# EAGLE design NP-100v12 (EAGLE 6.5.0)
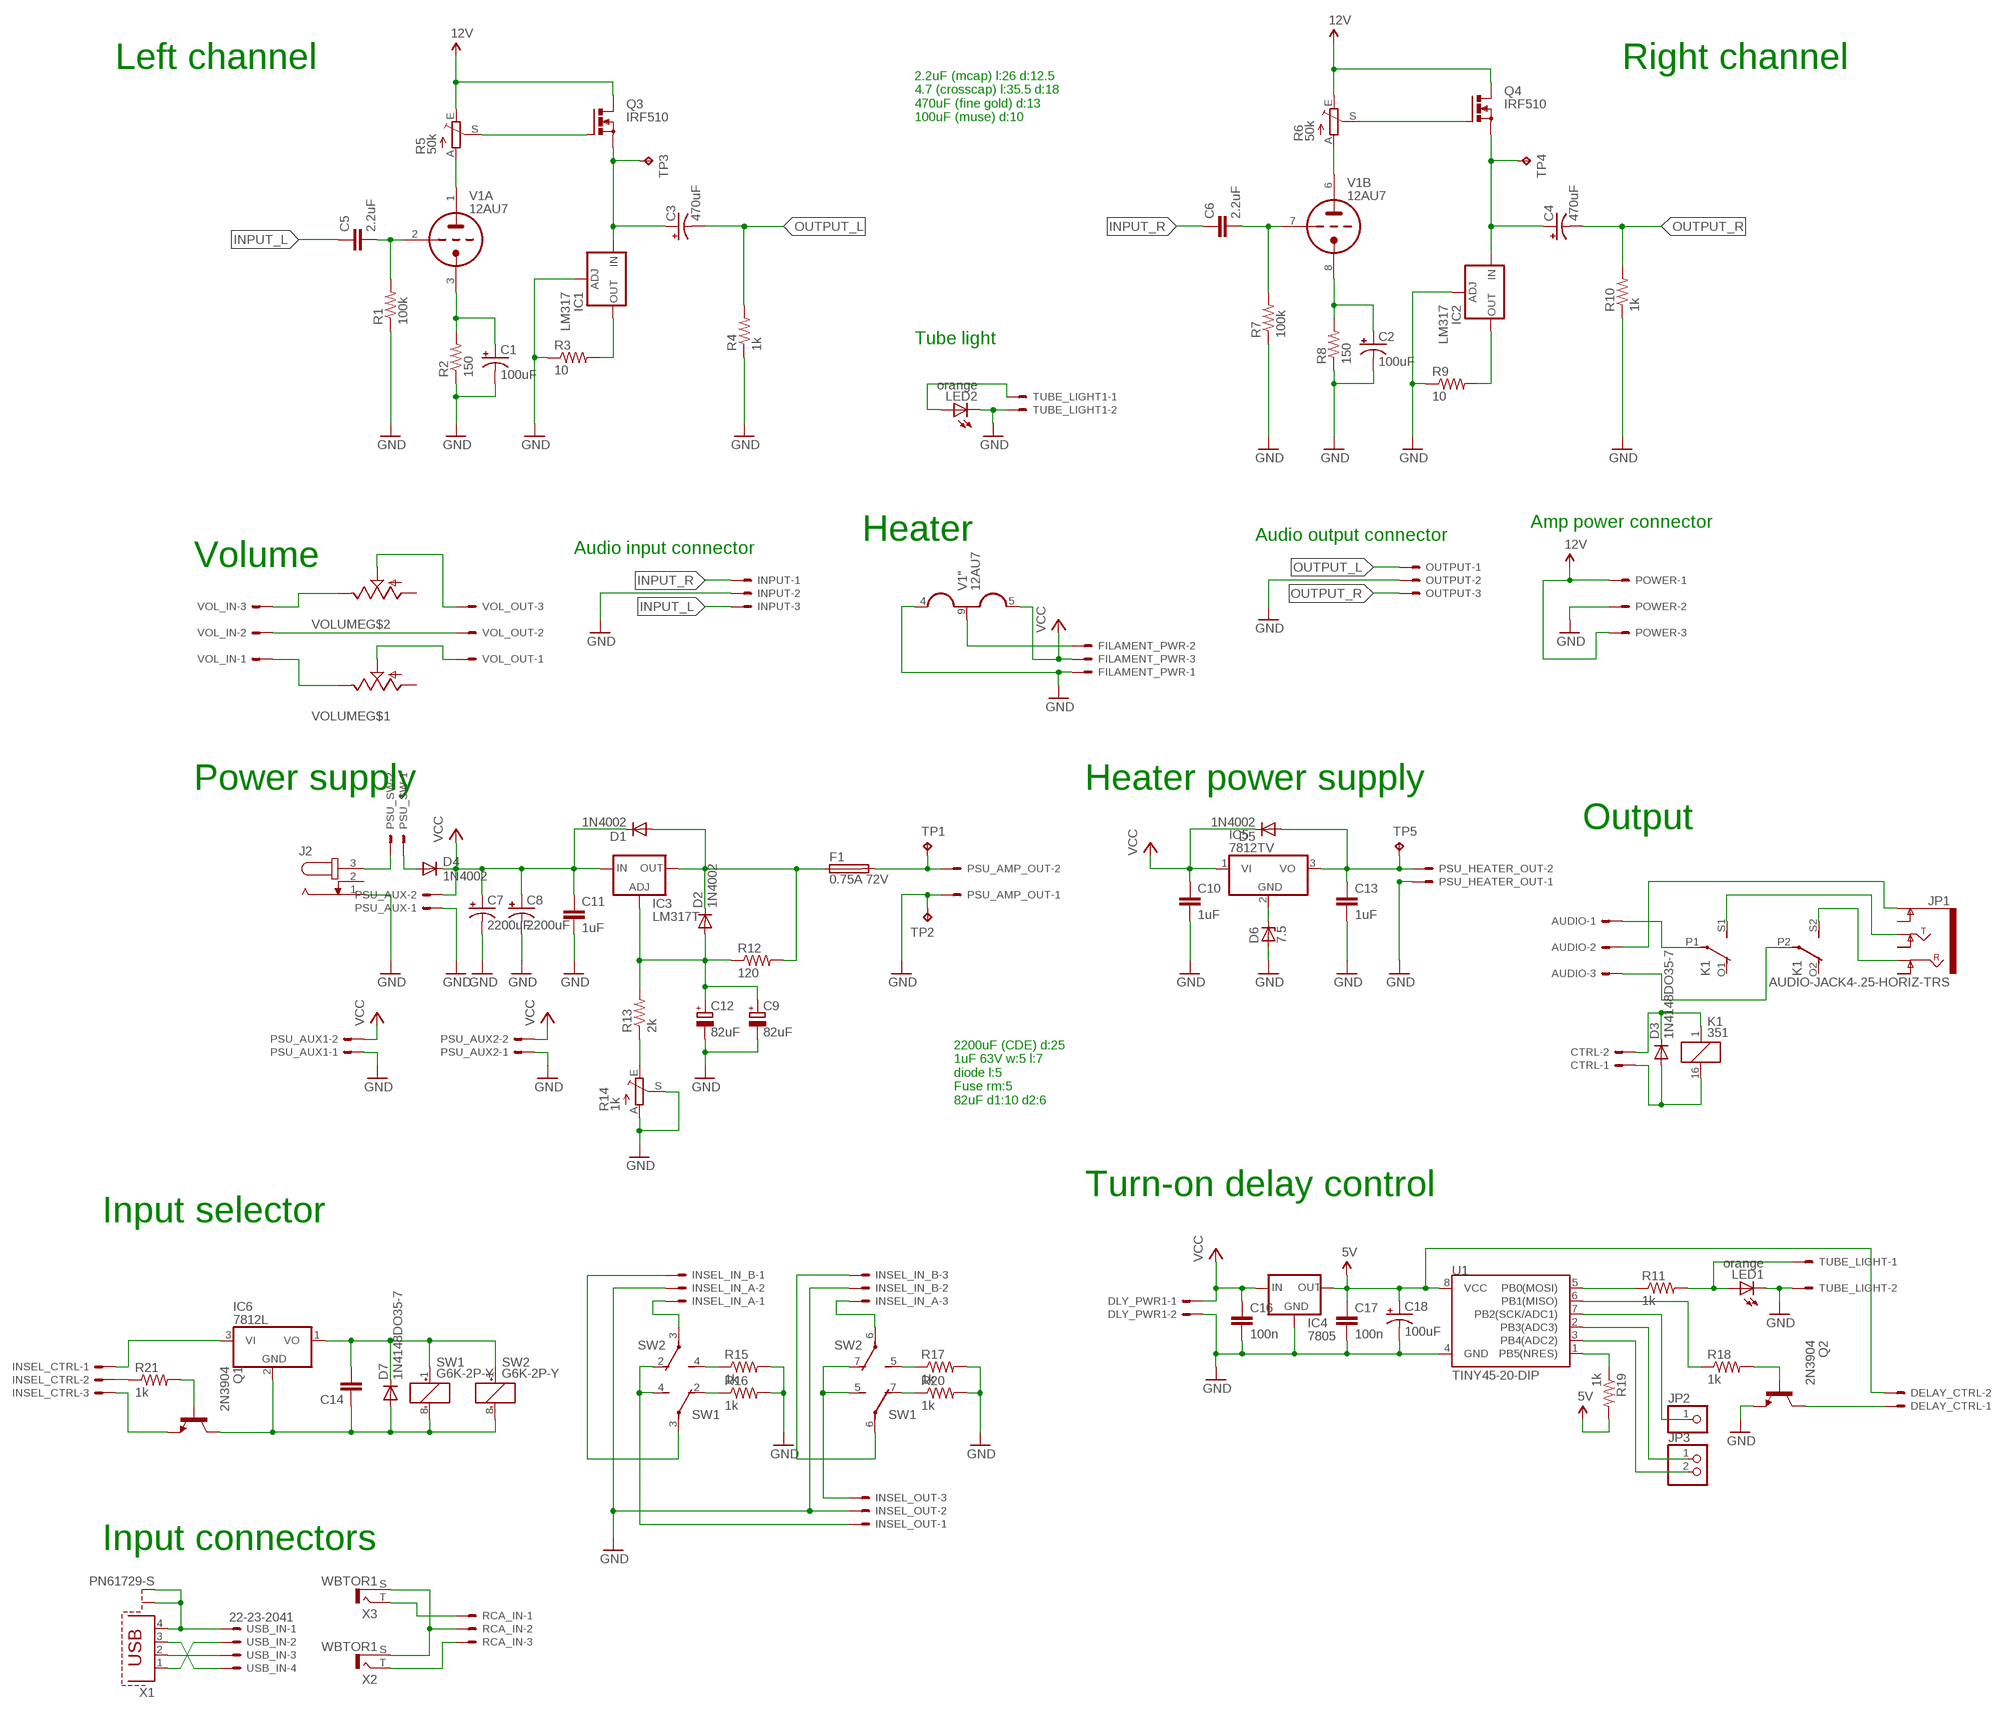
[diagram p0: schematic, sheet 1]

## Parts
AUDIO  22-23-2031  [22-23-2031]
C1  100uF  CPOL-USE5-10.5  [E5-10,5]
C2  100uF  CPOL-USE5-10.5  [E5-10,5]
C3  470uF  CPOL-USE5-13  [E5-13]
C4  470uF  CPOL-USE5-13  [E5-13]
C5  2.2uF  C37/19  [C37.5B19]
C6  2.2uF  C37/19  [C37.5B19]
C7  2200uF  CPOL-USE10-25  [EB25D]
C8  2200uF  CPOL-USE10-25  [EB25D]
C9  82uF  CPOL-EUE2.5-6  [E2,5-6]
C10  1uF  C5/4.5  [C5B4.5]
C11  1uF  C5/4.5  [C5B4.5]
C12  82uF  CPOL-EUE5-10.5  [E5-10,5]
C13  1uF  C5/4.5  [C5B4.5]
C14  C5/2.5  [C5B2.5]
C16  100n  CAPPTH1  [CAP-PTH-5MM]
C17  100n  CAPPTH1  [CAP-PTH-5MM]
C18  100uF  CPOL-USE2.5-7  [E2,5-7]
CTRL  22-23-2021  [22-23-2021]
D1  1N4002  DIODE-D-7.5  [D-7.5]
D2  1N4002  DIODE-D-7.5  [D-7.5]
D3  1N4148DO35-7  [DO35-7]
D4  1N4002  DIODE-D-5  [D-5]
D5  1N4002  DIODE-D-7.5  [D-7.5]
D6  7.5  ZENER-DIODEDO34-7  [DO34Z7]
D7  1N4148DO35-7  [DO35-7]
DELAY_CTRL  22-23-2021  [22-23-2021]
DLY_PWR1  22-23-2021  [22-23-2021]
F1  0.75A 72V  TE5  [TE5]
FILAMENT_PWR  22-23-2031  [22-23-2031]
IC1  LM317  LM317TS  [317TS]
IC2  LM317  LM317TS  [317TS]
IC3  LM317T  LM317TS  [317TS]
IC4  7805  V_REG_78XXTO-92_UNTESTED  [TO-92]
IC5  7812TV  [TO220V]
IC6  7812L  [TO92]
INPUT  22-23-2031  [22-23-2031]
INSEL_CTRL  22-23-2031  [22-23-2031]
INSEL_IN_A  22-23-2031  [22-23-2031]
INSEL_IN_B  22-23-2031  [22-23-2031]
INSEL_OUT  22-23-2031  [22-23-2031]
J2  JACK-PLUG0  [SPC4077]
JP1  AUDIO-JACK4-.25-HORIZ-TRS  [AUDIO-JACK-.25-INCH-HORIZ-PTH]
JP2  PINHD-1X1  [1X01]
JP3  PINHD-1X2  [1X02]
K1  351  [351]
LED1  orange  LED3MM  [LED3MM]
LED2  orange  LED3MM  [LED3MM]
OUTPUT  22-23-2031  [22-23-2031]
POWER  22-23-2031  [22-23-2031]
PSU_AMP_OUT  22-23-2021  [22-23-2021]
PSU_AUX  22-23-2021  [22-23-2021]
PSU_AUX1  22-23-2021  [22-23-2021]
PSU_AUX2  22-23-2021  [22-23-2021]
PSU_HEATER_OUT  22-23-2021  [22-23-2021]
PSU_SW  22-23-2021  [22-23-2021]
Q1  2N3904  [TO92]
Q2  2N3904  [TO92]
Q3  IRF510  PMOSFET_NTO220BV  [TO220BV]
Q4  IRF510  PMOSFET_NTO220BV  [TO220BV]
R1  100k  R-US_0207/10  [0207/10]
R2  150  R-US_0207/10  [0207/10]
R3  10  R-US_0207/10  [0207/10]
R4  1k  R-US_0207/10  [0207/10]
R5  50k  TRIM_EU-B90P  [SP19L]
R6  50k  TRIM_EU-B90P  [SP19L]
R7  100k  R-US_0207/10  [0207/10]
R8  150  R-US_0207/10  [0207/10]
R9  10  R-US_0207/10  [0207/10]
R10  1k  R-US_0207/10  [0207/10]
R11  1k  R-US_0204/7  [0204/7]
R12  120  RESISTORAXIAL-0.3  [AXIAL-0.3]
R13  2k  RESISTORAXIAL-0.3  [AXIAL-0.3]
R14  1k  TRIM_EU-S64Y  [S64Y]
R15  1k  RESISTORAXIAL-0.3  [AXIAL-0.3]
R16  1k  RESISTORAXIAL-0.3  [AXIAL-0.3]
R17  1k  RESISTORAXIAL-0.3  [AXIAL-0.3]
R18  1k  R-US_0204/7  [0204/7]
R19  1k  R-US_0204/7  [0204/7]
R20  1k  RESISTORAXIAL-0.3  [AXIAL-0.3]
R21  1k  R-US_0204/7  [0204/7]
RCA_IN  22-23-2031  [22-23-2031]
SW1  G6K-2P-Y  [G6K-2P-Y]
SW2  G6K-2P-Y  [G6K-2P-Y]
TP1  TPPAD1-17  [P1-17]
TP2  TPPAD1-17  [P1-17]
TP3  TPPAD1-17  [P1-17]
TP4  TPPAD1-17  [P1-17]
TP5  TPPAD1-17  [P1-17]
TUBE_LIGHT  22-23-2021  [22-23-2021]
TUBE_LIGHT1  22-23-2021  [22-23-2021]
U1  TINY45-20-DIP  ATTINY45TINY45-20-DIP  [DIP08]
USB_IN  22-23-2041  [22-23-2041]
V1  12AU7  12AU7-P  [NOVAL]
VOL_IN  22-23-2031  [22-23-2031]
VOL_OUT  22-23-2031  [22-23-2031]
VOLUME  ALPS_BLUE  [ALPS_RK27]
X1  PN61729-S  [PN61729-S]
X2  WBTOR1  [WBTOR1]
X3  WBTOR1  [WBTOR1]

## Nets
5V: C17.1 C18.+ DELAY_CTRL.2 IC4.3(OUT) R19.2 U1.8(VCC)
12V: POWER.1 POWER.3 Q3.D Q4.D R5.E R6.E
GND: C1.- C2.- C7.- C8.- C9.- C10.2 C11.2 C12.- C13.2 C16.2 C17.2 C18.- D6.A DLY_PWR1.2 FILAMENT_PWR.1 IC1.1(ADJ) IC2.1(ADJ) IC4.1(GND) INPUT.2 INSEL_IN_A.2 INSEL_IN_B.2 INSEL_OUT.2 J2.1 LED1.K(C) LED2.K(C) OUTPUT.2 POWER.2 PSU_AMP_OUT.1 PSU_AUX1.1 PSU_AUX2.1 PSU_AUX.1 PSU_HEATER_OUT.1 Q2.3(E) R1.1 R2.1 R3.1 R4.1 R7.1 R8.1 R9.1 R10.1 R14.A R14.S R15.P$2 R16.P$2 R17.P$2 R20.P$2 TP2.TP TUBE_LIGHT1.2 TUBE_LIGHT.2 U1.4(GND) V1.4(":H1)
INPUT_L: C5.1 INPUT.3
INPUT_R: C6.1 INPUT.1
N$1: C5.2 R1.2 V1.2(A:TG)
N$2: C1.+ R2.2 V1.3(A:TK)
N$3: R5.A V1.1(A:TA)
N$4: Q3.G R5.S
N$5: C3.+ IC1.3(IN) Q3.S TP3.TP
N$6: IC1.2(OUT) R3.2
N$7: C6.2 R7.2 V1.7(B:TG)
N$8: R11.1 U1.5(PB0(MOSI))
N$9: IC2.2(OUT) R9.2
N$10: C2.+ R8.2 V1.8(B:TK)
N$11: R6.A V1.6(B:TA)
N$12: Q4.G R6.S
N$13: C4.+ IC2.3(IN) Q4.S TP4.TP
N$14: D6.C IC5.2(GND)
N$15: D1.A D2.C F1.1 IC3.2(OUT) R12.P$2
N$16: F1.2 PSU_AMP_OUT.2 TP1.TP
N$17: C9.+ C12.+ D2.A IC3.1(ADJ) R12.P$1 R13.P$2
N$18: R13.P$1 R14.E
N$19: C13.1 D5.A IC5.3(VO) PSU_HEATER_OUT.2 TP5.TP
N$20: FILAMENT_PWR.2 V1.9(":H2)
N$21: AUDIO.1 K1.P1(2:P)
N$22: CTRL.1 D3.A K1.16
N$23: R15.P$1 SW2.4(2:S)
N$24: LED2.A TUBE_LIGHT1.1
N$25: C14.2 D7.C IC6.1(VO) SW1.1(1:+) SW2.1(1:+)
N$26: R16.P$1 SW1.2(2:O)
N$27: AUDIO.3 K1.P2(3:P)
N$28: JP1.TIP K1.S1(2:S)
N$29: AUDIO.2 JP1.SLEEVE(EARTH)
N$30: JP1.RING K1.S2(3:S)
N$31: VOL_IN.3 VOLUME.I2
N$32: VOL_IN.2 VOL_OUT.2
N$33: VOL_IN.1 VOLUME.I1
N$34: VOL_OUT.3 VOLUME.O2
N$35: VOL_OUT.1 VOLUME.O1
N$36: J2.3 PSU_SW.2
N$37: CTRL.2 D3.C K1.1
N$38: LED1.A R11.2 TUBE_LIGHT.1
N$39: R17.P$1 SW2.5(3:S)
N$40: R18.1 U1.6(PB1(MISO))
N$41: Q2.2(B) R18.2
N$42: DELAY_CTRL.1 Q2.1(C)
N$43: JP2.1 U1.7(PB2(SCK/ADC1))
N$44: R19.1 U1.1(PB5(NRES))
N$45: JP3.1 U1.2(PB3(ADC3))
N$46: JP3.2 U1.3(PB4(ADC2))
N$47: D4.A PSU_SW.1
N$48: R20.P$1 SW1.7(3:O)
N$50: INSEL_IN_A.1 SW2.3(2:P)
N$51: INSEL_IN_A.3 SW2.6(3:P)
N$52: INSEL_IN_B.1 SW1.3(2:P)
N$53: INSEL_IN_B.3 SW1.6(3:P)
N$54: INSEL_OUT.3 SW1.5(3:S) SW2.7(3:O)
N$55: INSEL_OUT.1 SW1.4(2:S) SW2.2(2:O)
N$56: Q1.2(B) R21.2
N$57: IC6.3(VI) INSEL_CTRL.1
N$58: INSEL_CTRL.2 R21.1
N$59: INSEL_CTRL.3 Q1.3(E)
N$60: C14.1 D7.A IC6.2(GND) Q1.1(C) SW1.8(1:-) SW2.8(1:-)
N$61: RCA_IN.2 X2.S X3.S
N$62: RCA_IN.1 X3.T
N$63: RCA_IN.3 X2.T
N$64: USB_IN.1 X1.4 X1.S1 X1.S2
N$65: USB_IN.4 X1.3
N$66: USB_IN.3 X1.2
N$67: USB_IN.2 X1.1
OUTPUT_L: C3.- OUTPUT.1 R4.2
OUTPUT_R: C4.- OUTPUT.3 R10.2
VCC: C7.+ C8.+ C10.1 C11.1 C16.1 D1.C D4.C D5.C DLY_PWR1.1 FILAMENT_PWR.3 IC3.3(IN) IC4.2(IN) IC5.1(VI) PSU_AUX1.2 PSU_AUX2.2 PSU_AUX.2 V1.5(":H3)
Unconnected: J2.2 JP1.RING-NORM JP1.SLEEVE-NORM(EARTH-NORM) JP1.TIP-NORM K1.O1(2:O) K1.O2(3:O) VOLUME.G1 VOLUME.G2

## Notes on the sheet
- Left channel | Right channel
- 2.2uF (mcap) l:26 d:12.5
  4.7 (crosscap) l:35.5 d:18
  470uF (fine gold) d:13
  100uF (muse) d:10
- Tube light
- Amp power connector
- Heater | Audio output connector
- Audio input connector
- Volume
- Power supply | Heater power supply
- Output
- 2200uF (CDE) d:25
  1uF 63V w:5 l:7 
  diode l:5
  Fuse rm:5
  82uF d1:10 d2:6
- Turn-on delay control
- Input selector
- Input connectors

## Library data of the parts
AUDIO FILAMENT_PWR INPUT INSEL_CTRL INSEL_IN_A INSEL_IN_B INSEL_OUT OUTPUT POWER RCA_IN VOL_IN VOL_OUT = con-molex:22-23-2031: .100" (2.54mm) Center Header - 3 Pin; MF: MOLEX; MPN: 22-23-2031; OC_FARNELL: 1462950; OC_NEWARK: 30C0862
C1-C4 C7 C8 C18 = adafruit:CPOL-US: POLARIZED CAPACITOR, American symbol
C5 C6 C10 C11 C13 C14 = capacitor-wima:C: CAPACITOR naming: grid - package width
C9 C12 = resistor:CPOL-EU: POLARIZED CAPACITOR, European symbol
C16 C17 = SparkFun:CAP: Capacitor Standard 0603 ceramic capacitor, and 0.1" leaded capacitor.
CTRL DELAY_CTRL DLY_PWR1 PSU_AMP_OUT PSU_AUX PSU_AUX1 PSU_AUX2 PSU_HEATER_OUT PSU_SW TUBE_LIGHT TUBE_LIGHT1 = con-molex:22-23-2021: .100" (2.54mm) Center Header - 2 Pin; MF: MOLEX; MPN: 22-23-2021; OC_FARNELL: 1462926; OC_NEWARK: 25C3832
D1 D2 D4 D5 = diode:DIODE-: DIODE
D3 D7 = diode:1N4148: DIODE high speed (Philips)
D6 = diode:ZENER-DIODE: Z-Diode
F1 = fuse:TE5: FUSE Wickmann; OC_FARNELL: unknown; OC_NEWARK: unknown
IC1-IC3 = v-reg:LM317TS: VOLTAGE REGULATOR
IC4 = SparkFun-PowerIC:V_REG_78XX: Voltage Regulator Standard 7805 5V regulator. IGO (Input Ground Output). Spark Fun Electronics SKU : COM-00107
IC5 IC6 = linear:78*: Positive VOLTAGE REGULATOR Source: http://cache.national.com/ds/LM/LM78L05.pdf http://www.fairchildsemi.com/ds/LM/LM7805.pdf
J2 = con-jack:JACK-PLUG: DC POWER JACK Power Jack, DC, Right Angle, Through Hole, Rated 5A at 16VDC, PC Terminals Distributor: Farnell (www.Farnell.de) Drawing: 84N1161.pdf / 84N1162.pdf Manufacturer: SPC Technology (www.spctechnology.com) Type: SPC4077 / SPC 4078; OC_FARNELL: unknown; OC_NEWARK: unknown
JP1 = SparkFun-Connectors:AUDIO-JACK4-.25-HORIZ-TRS: 1/4" TRS jack, horizontal Production SKU: COM-11144 Footprint unproven - datasheet and part seem to be slightly different; PROD_ID: COM-11144
JP2 = adafruit:PINHD-1X1: Pin header 1x1 for 0.1" spacing With round pins
JP3 = pinhead:PINHD-1X2: PIN HEADER
K1 = relay:351: RELAY 2 x switch, Omron; OC_FARNELL: unknown; OC_NEWARK: unknown
LED1 LED2 = adafruit:LED: LED OSRAM: - CHIPLED LG R971, LG N971, LY N971, LG Q971, LY Q971, LO R971, LY R971 LH N974, LH R974 LS Q976, LO Q976, LY Q976 LO Q996 - Hyper CHIPLED LW Q18S LB Q993, LB Q99A, LB R99A - SideLED LS A670, LO A670, LY A670, LG A670, LP A670 LB A673, LV A673, LT A673, LW A673 LH A674 LY A675 LS A676, LA A676, LO A676, LY A676, LW A676 LS A679, LY A679, LG A679 - Hyper Micro SIDELED® LS Y876, LA Y876, LO Y876, LY Y876 LT Y87S - SmartLED LW L88C, LW L88S LB L89C, LB L89S, LG L890 LS L89K, LO L89K, LY L89K LS L896, LA L896, LO L896, LY L896 - TOPLED LS T670, LO T670, LY T670, LG T670, LP T670 LSG T670, LSP T670, LSY T670, LOP T670, LYG T670 LG T671, LOG T671, LSG T671 LB T673, LV T673, LT T673, LW T673 LH T674 LS T676, LA T676, LO T676, LY T676, LB T676, LH T676, LSB T676, LW T676 LB T67C, LV T67C, LT T67C, LS T67K, LO T67K, LY T67K, LW E67C LS E67B, LA E67B, LO E67B, LY E67B, LB E67C, LV E67C, LT E67C LW T67C LS T679, LY T679, LG T679 LS T770, LO T770, LY T770, LG T770, LP T770 LB T773, LV T773, LT T773, LW T773 LH T774 LS E675, LA E675, LY E675, LS T675 LS T776, LA T776, LO T776, LY T776, LB T776 LHGB T686 LT T68C, LB T68C - Hyper Mini TOPLED® LB M676 - Mini TOPLED Santana® LG M470 LS M47K, LO M47K, LY M47K Source: http://www.osram.convergy.de/
Q1 Q2 = transistor:2N3904: NPN TRANSISTOR
Q3 Q4 = transistor-power:PMOSFET_N: Power MOSFET N-Channel
R1-R4 R7-R11 R18 R19 R21 = adafruit:R-US_: RESISTOR, American symbol
R5 R6 R14 = pot:TRIM_EU-: POTENTIOMETER
R12 R13 R15-R17 R20 = SparkFun:RESISTOR: Resistor Basic schematic elements and footprints for 0603, 1206, and PTH resistors.
SW1 SW2 = relay:G6K: Low Signal Relay oeiwcsnts1.omron.com/.. D20G6K0100.pdf; MF: OMRON COMPONENTS USA; MPN: G6K-2P-Y DC12; OC_FARNELL: 3937276; OC_NEWARK: 34C3464
TP1-TP5 = testpad:TP: Test pad
U1 = SparkFun-DigitalIC:ATTINY45: Atmel 8-pin 2/4/8kB flash uC; PROD_ID: IC-09439
USB_IN = con-molex:22-23-2041: .100" (2.54mm) Center Header - 4 Pin; MF: MOLEX; MPN: 22-23-2041; OC_FARNELL: 1462920; OC_NEWARK: 38C0355
V1 = tubes:12AU7-P
VOLUME = audio-pots:ALPS_BLUE: Alps Blue potentiometer
X1 = con-berg:PN61729-S: BERG USB connector; OC_FARNELL: unknown; OC_NEWARK: unknown
X2 X3 = con-lumberg:WBTOR1: RCA connectors according to JEITA RC-5231 Cinch RCA-Einbaukupplung nach JEITA RC-5231, abgewinkelte Ausführung Source: http://www.lumberg.de/Produkte/PDFs/WBTOR1.pdf; MPN: WBTOR 1 BLACK; OC_FARNELL: 1200146; OC_NEWARK: 98K2588

## Board
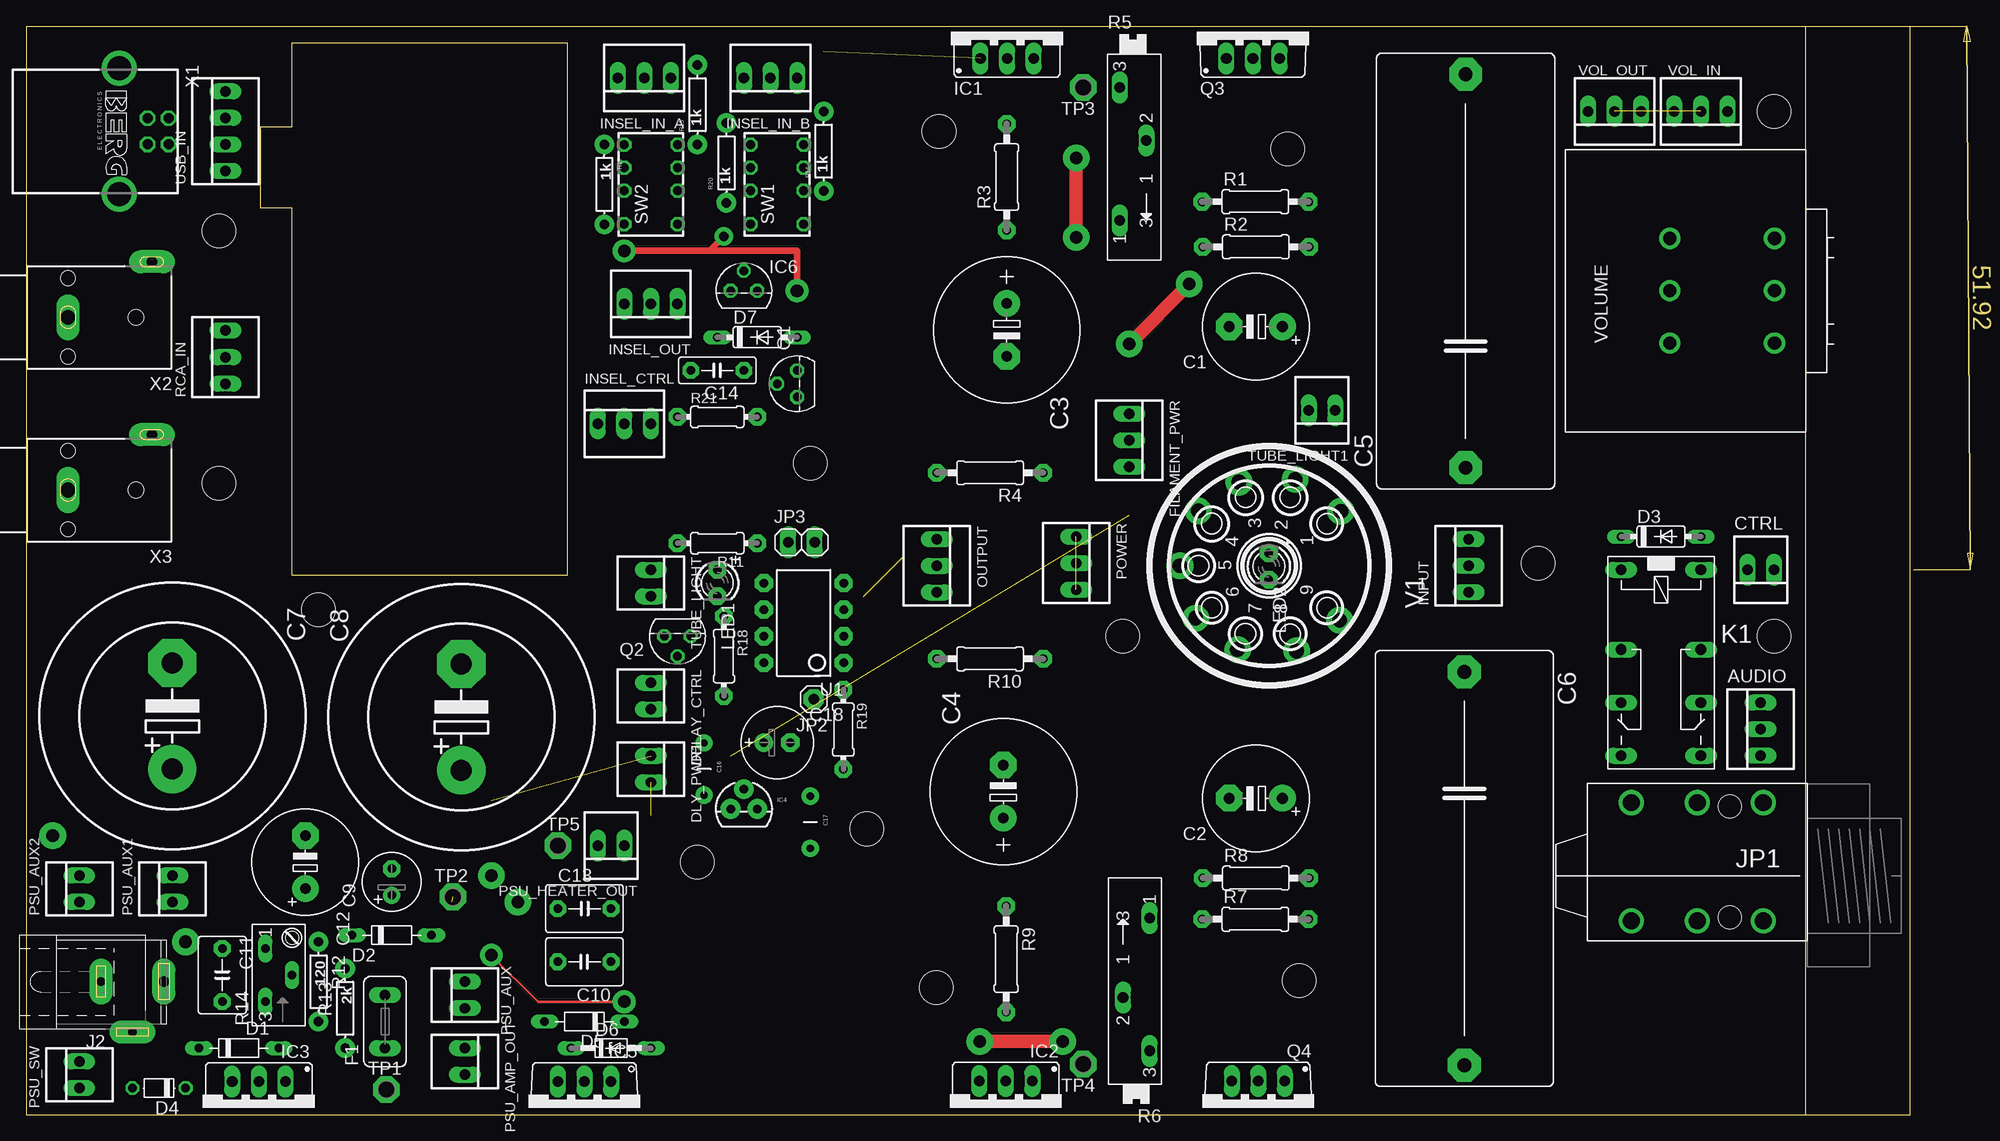
[diagram p1: board, top side]
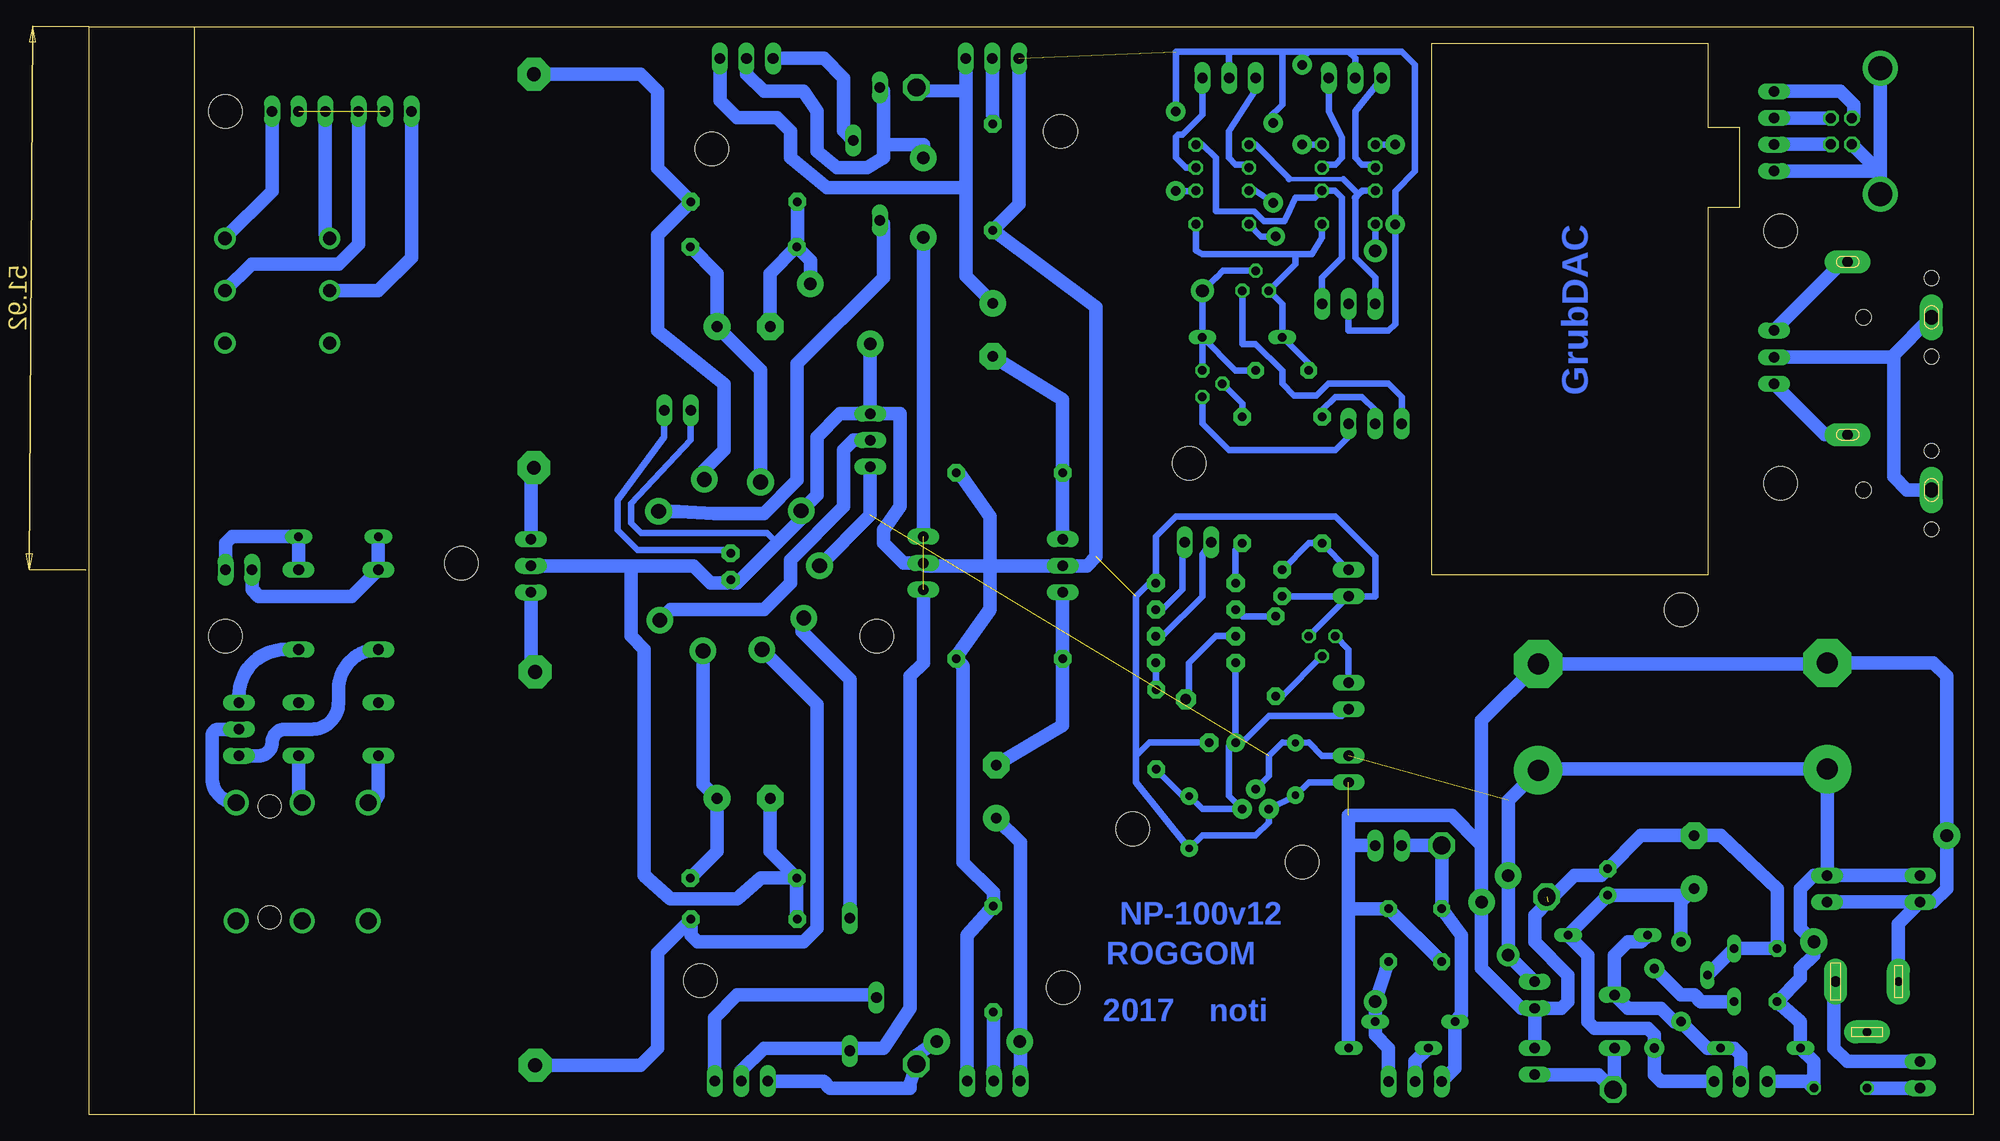
[diagram p2: board, bottom side, seen from below]

Size 180.01 x 103.99 mm. Coordinates in mm from the lower left corner, seen from the top.
Outline: 170,103.99 0,103.99 0,0 170,0
Outline: 170,103.99 180.01,103.99 180.01,0 170,0
Outline: 170,103.99 170,0
Outline: 22.35,86.67 25.35,86.67 25.35,51.59 51.74,51.59 51.74,102.39 25.35,102.39 25.35,94.39 22.35,94.39 22.35,86.67
Copper layers (1*16): Top 0.035mm / dielectric 1.5mm / Bottom 0.035mm
Design rules "default": minimum track width 10mil, minimum drill 24mil, track to track 8mil, track to pad 8mil, pad to pad 8mil, via to via 8mil, smd to smd 8mil, copper to edge 40mil, drill to drill 8mil, minimum pad ring 10mil, minimum via ring 8mil, stop-mask expansion 4mil, vias tented up to drill 0mil, thermal gap 10mil
Holes 3.2 mm at 80.33,27.3 27.94,48.26 144.46,52.7 74.93,62.23 18.41,60.33 64.14,24.13 121.64,12.83 120.52,92.3 167,95.89 167,45.72 87.22,93.98 86.97,12.14 18.41,84.45 104.78,45.72

### Footprints (pad centres in the part's own frame; a part is rotated, then mirrored left to right if it is on the bottom)
22-23-2031 = drill 1 long: 1 -2.54,0; 2 0,0; 3 2.54,0
E5-10,5 = drill 1.016 pad 2.54: + -2.54,0 | drill 1.016 pad 2.54 octagon: - 2.54,0
E5-13 = drill 1.016 pad 2.54: + -2.54,0 | drill 1.016 pad 2.54 octagon: - 2.54,0
C37.5B19 = drill 1.321 pad 3.15 octagon: 1 -18.796,0; 2 18.796,0
EB25D = drill 2.007 pad 4.597: + -5.08,0 | drill 2.007 pad 4.597 octagon: - 5.08,0
E2,5-6 = drill 0.813 pad 1.6: + -1.27,0 | drill 0.813 pad 1.6 octagon: - 1.27,0
C5B4.5 = drill 0.813 pad 1.6 octagon: 1 -2.54,0; 2 2.54,0
C5B2.5 = drill 0.813 pad 1.6 octagon: 1 -2.54,0; 2 2.54,0
CAP-PTH-5MM = drill 0.7 pad 1.651: 1 -2.5,0; 2 2.5,0
E2,5-7 = drill 0.813 pad 1.778: + -1.27,0 | drill 0.813 pad 1.778 octagon: - 1.27,0
22-23-2021 = drill 1 long: 1 -1.27,0; 2 1.27,0
D-7.5 = drill 0.813 long: A 3.81,0; C -3.81,0
DO35-7 = drill 0.813 long: A 3.81,0; C -3.81,0
D-5 = drill 0.813 octagon: A 2.54,0; C -2.54,0
DO34Z7 = drill 0.813 long: A 3.81,0; C -3.81,0
TE5 = drill 1.016 long: 1 -2.54,0; 2 2.54,0
317TS = drill 1.016 long: 1 -2.54,-2.54; 2 0,-2.54; 3 2.54,-2.54
TO-92 = drill 0.813 pad 1.88: 1 -1.27,0; 2 0,1.905; 3 1.27,0
TO220V = drill 1.016 long: 1 -2.54,-2.54; 2 0,-2.54; 3 2.54,-2.54
TO92 = drill 0.813 octagon: 1 -1.27,0; 2 0,1.905; 3 1.27,0
SPC4077 = drill 0.8 pad 2.184 long: 1 -3,0; 2 0,-4.8 | drill 1 pad 2.184 long: 3 3,0
AUDIO-JACK-.25-INCH-HORIZ-PTH = drill 1.6: RING 10.5,-6.95; RING-NORM 10.5,4.35; SLEEVE 4.2,-6.95; SLEEVE-NORM 4.2,4.35; TIP 16.8,-6.95; TIP-NORM 16.8,4.35 | hole 2.2: 7.4,4; 7.4,-6.6
1X01 = drill 1.016 pad 1.93 octagon: 1 0,0
1X02 = drill 1.016 long: 1 -1.27,0; 2 1.27,0
351 = drill 1.016 long: 1 -3.81,-3.81; 16 -3.81,3.81; O1 8.89,-3.81; O2 8.89,3.81; P1 3.81,-3.81; P2 3.81,3.81; S1 13.97,-3.81; S2 13.97,3.81
LED3MM = drill 0.813 pad 1.676 octagon: A -1.27,0; K 1.27,0
TO92' = drill 0.813 octagon: 1 1.27,0; 2 0,1.905; 3 -1.27,0
TO220BV = drill 1.016 long: D 0,-2.54; G -2.54,-2.54; S 2.54,-2.54
0207/10 = drill 0.813 pad 1.676 octagon: 1 -5.08,0; 2 5.08,0
SP19L = drill 1.016 long: A 5.715,-1.27; E -6.985,-1.27; S -1.905,1.27
0204/7 = drill 0.813 pad 1.676 octagon: 1 -3.81,0; 2 3.81,0
AXIAL-0.3 = drill 0.9 pad 1.88: P$1 -3.81,0; P$2 3.81,0
S64Y = drill 0.813 long: A 2.54,1.27; E -2.54,1.27; S 0,-1.27
G6K-2P-Y = drill 0.85 octagon: 1 0,-2.54; 2 3.2,-2.54; 3 5.4,-2.54; 4 7.6,-2.54; 5 7.6,2.54; 6 5.4,2.54; 7 3.2,2.54; 8 0,2.54
P1-17 = drill 1.702 pad 2.54 octagon: TP 0,0
DIP08 = drill 0.813 pad 1.727 octagon: 1 -3.81,-3.81; 2 -1.27,-3.81; 3 1.27,-3.81; 4 3.81,-3.81; 5 3.81,3.81; 6 1.27,3.81; 7 -1.27,3.81; 8 -3.81,3.81
22-23-2041 = drill 1 long: 1 -3.81,0; 2 -1.27,0; 3 1.27,0; 4 3.81,0
NOVAL = drill 1.422 pad 2.54: 1 5.207,-6.858; 2 8.254,-2.484; 3 8.004,2.893; 4 5.258,6.77; 5 0,8.524; 6 -5.004,7.024; 7 -8.004,3.02; 8 -8.127,-2.611; 9 -5.207,-6.731
ALPS_RK27 = drill 1.27 pad 2.032: G1 5,4.5; G2 5,-5.5; I1 -5,4.5; I2 -5,-5.5; O1 0,4.5; O2 0,-5.5
PN61729-S = drill 0.95 octagon: 1 1.25,4.71; 2 -1.25,4.71; 3 -1.25,2.71; 4 1.25,2.71 | drill 2.3 pad 2.9: S1 -6.02,0; S2 6.02,0
WBTOR1 = drill 1.4 pad 2.2 long: S 0,-4 | drill 1 pad 2.2 long: T 5.3,-12 | hole 1.4: -3.75,-4; 3.75,-4 | hole 1.5: 0,-10.5

### Placement (x,y rotation side)
AUDIO  165.74,36.83 90 top
C1  117.5,75.31 180 top
C2  117.5,30.23 180 top
C3  93.69,74.99 270 top
C4  93.37,30.86 90 top
C5  137.54,80.62 90 top
C6  137.41,23.52 270 top
C7  13.97,38.1 90 top
C8  41.58,38 90 top
C9  34.92,22.23 90 top
C10  53.34,14.61 180 top
C11  18.73,13.34 90 top
C12  26.67,24.13 90 top
C13  53.34,19.68 0 top
C14  66.04,71.12 180 top
C16  64.77,33.02 270 top
C17  74.93,27.94 270 top
C18  71.75,35.56 0 top
CTRL  165.74,52.07 180 top
D1  20.32,6.35 0 top
D2  34.92,17.14 0 top
D3  156.21,55.24 0 top
D4  12.7,2.54 180 top
D5  53.34,8.89 180 top
D6  55.88,6.35 0 top
D7  69.85,74.3 0 top
DELAY_CTRL  59.69,40.01 270 top
DLY_PWR1  59.69,33.02 270 top
F1  34.29,8.89 270 top
FILAMENT_PWR  105.41,64.45 270 top
IC1  93.73,103.48 0 top
IC2  93.6,0.66 180 top
IC3  22.23,0.64 180 top
IC4  68.58,29.21 0 top
IC5  53.34,0.64 180 top
IC6  68.58,78.74 0 top
INPUT  137.82,52.45 90 top
INSEL_CTRL  57.15,66.04 0 top
INSEL_IN_A  59.05,99.06 180 top
INSEL_IN_B  71.12,99.06 180 top
INSEL_OUT  59.69,77.47 180 top
J2  10.16,12.7 0 top
JP1  170.18,22.86 180 top
JP2  75.25,39.69 180 top
JP3  74.08,54.69 0 top
K1  156.21,48.26 270 top
LED1  66.04,50.8 270 top
LED2  118.75,52.39 270 top
OUTPUT  87.02,52.45 270 top
POWER  100.33,52.7 270 top
PSU_AMP_OUT  41.91,5.08 270 top
PSU_AUX  41.91,11.43 90 top
PSU_AUX1  13.97,21.59 90 top
PSU_AUX2  5.08,21.59 90 top
PSU_HEATER_OUT  55.88,25.72 180 top
PSU_SW  5.08,3.81 90 top
Q1  2N3904  [TO92']  73.66,69.85 90 top
Q2  2N3904  [TO92']  62.23,45.72 180 top
Q3  117.22,103.48 0 top
Q4  117.73,0.66 180 top
R1  117.45,87.25 0 top
R2  117.5,82.93 0 top
R3  93.69,89.6 90 top
R4  92.1,61.34 180 top
R5  105.75,91.19 270 top
R6  106.07,13.08 90 top
R7  117.45,18.67 0 top
R8  117.5,22.61 0 top
R9  93.64,14.86 270 top
R10  92.1,43.56 180 top
R11  66.04,54.61 180 top
R12  27.94,12.7 270 top
R13  30.48,10.16 270 top
R14  24.13,13.34 90 top
R15  64.14,96.52 90 top
R16  76.2,92.08 90 top
R17  55.24,88.9 270 top
R18  66.67,43.81 270 top
R19  78.08,36.8 270 top
R20  66.9,90.96 90 top
R21  66.04,66.67 0 top
RCA_IN  19.05,72.39 90 top
SW1  71.75,85.09 90 top
SW2  59.69,85.09 90 top
TP1  34.42,2.39 0 top
TP2  40.77,20.8 0 top
TP3  100.99,98.17 180 top
TP4  100.99,4.83 180 top
TP5  50.8,25.72 0 top
TUBE_LIGHT  59.69,50.8 270 top
TUBE_LIGHT1  123.83,67.31 180 top
U1  74.3,46.99 90 top
USB_IN  19.05,93.98 90 top
V1  118.77,52.45 90 top
VOL_IN  160.02,95.89 180 top
VOL_OUT  151.76,95.89 180 top
VOLUME  162.56,78.74 270 top
X1  8.89,93.98 270 top
X2  0,76.2 90 top
X3  0,59.69 90 top

### Tracks (layer width: path | path; a pad name or v marks a point on that pad's centre or on a via)
5V
  Bottom 0.61: R19.2 75.56,30.48 C17.1 73.66,29.21 IC4.3 71.12,30.48 71.12,35.24 C18.+ | C18.+ U1.8 | C18.+ 69.53,35.88 67.31,38.1 60.33,38.1 DELAY_CTRL.2
12V  (via drill 1.2 pad 2.54)  (1 unrouted)
  Top 1.27: v100.33,83.82 v100.33,91.44
  Bottom 1.27: Q4.D 117.73,4.19 115.57,6.35 107.59,6.35 R6.E 107.09,6.35 104.14,6.35 101.6,10.16 101.6,41.91 100.33,43.18 POWER.3 | Q3.D 117.22,99.44 115.57,97.79 111.76,97.79 110.49,95.89 110.49,92.08 108.58,90.49 105.73,90.49 104.14,91.44 104.14,92.71 | 104.14,92.71 104.14,97.83 R5.E | POWER.1 v100.33,83.82 | v100.33,91.44 100.33,92.71 104.14,92.71
GND  (via drill 1.2 pad 2.54)  (4 unrouted)
  Top 1.27: v105.41,73.66 v111.12,79.38
  Bottom 0.61: R16.P$2 76.2,101.6 71.12,101.6 | 71.12,101.6 INSEL_IN_B.2 | INSEL_IN_A.2 59.05,100.97 59.69,101.6 | 59.69,101.6 63.5,101.6 | 63.5,101.6 66.04,101.6 | 66.04,101.6 71.12,101.6 | R20.P$2 67.31,95.25 66.04,96.52 66.04,101.6 | R15.P$2 64.14,100.97 63.5,101.6 | 59.69,101.6 54.61,101.6 53.34,100.33 53.34,90.17 55.24,88.27 R17.P$2 55.24,75.56 55.88,74.93 59.69,74.93 INSEL_OUT.2 | DLY_PWR1.2 63.5,31.75 C16.2 64.77,30.48 IC4.1 67.31,27.94 68.58,26.67 73.66,26.67 C17.2 77.47,28.57 80.01,31.75 80.01,34.29 | 80.01,34.29 78.74,35.56 C18.- | TUBE_LIGHT.2 Q2.3 | LED1.K TUBE_LIGHT.2 | 80.01,34.29 80.01,49.53 78.74,50.8 U1.4 78.11,55.24 76.2,57.15 60.96,57.15 57.15,53.34 57.15,49.53 TUBE_LIGHT.2 | TUBE_LIGHT1.2 122.56,64.45 128.27,58.42 128.27,56.52 127.32,55.56 115.25,55.56 114.3,54.61
  Bottom 1.27: J2.1 7.16,18.24 PSU_AUX2.1 | PSU_AUX2.1 PSU_AUX1.1 | PSU_AUX2.1 3.81,20.32 2.54,21.59 v2.54,26.67 2.54,41.91 3.81,43.18 C7.- 14.07,43.08 C8.- 46.99,37.67 46.99,26.04 | PSU_AUX.1 43.18,10.16 46.99,13.97 v46.99,20.32 46.99,26.04 | R14.S R14.A C11.2 18.73,21.59 24.13,26.67 C12.- 31.75,26.67 C9.- 35.56,22.86 38.1,22.86 40.16,20.8 TP2.TP | 40.64,20.32 41.91,19.05 41.91,16.51 38.73,13.34 38.73,10.79 39.37,10.16 PSU_AUX.1 | C10.2 C13.2 59.69,19.68 | D6.A 59.69,19.68 | 59.69,19.68 59.69,25.72 | 59.69,25.72 59.69,28.57 49.85,28.57 47.31,26.04 46.99,26.04 | PSU_AUX.1 PSU_AMP_OUT.1 | PSU_HEATER_OUT.1 59.69,25.72 | C2.- 114.96,25.15 R8.1 | R8.1 112.42,18.72 R7.1 | FILAMENT_PWR.1 108.27,66.99 110.49,64.77 110.49,59.22 V1.4 112,56.91 114.3,54.61 118.11,50.8 118.43,50.8 LED2.K 119.06,50.8 120.65,50.8 122.3,52.45 128.27,52.45 | 93.98,52.45 OUTPUT.2 84.71,52.45 83.82,53.34 83.82,77.19 R3.1 91.19,87.02 IC1.1 | 93.98,52.45 100.08,52.45 POWER.2 102.23,52.7 104.14,54.61 104.14,55.88 102.55,58.1 102.55,66.99 FILAMENT_PWR.1 | 93.98,52.45 93.98,48.26 97.18,43.79 R10.1 96.52,42.9 96.52,24.13 93.64,21.25 R9.1 96.14,17.12 IC2.1 | R4.1 96.9,61.34 93.98,57.15 93.98,52.45 | INPUT.2 128.27,52.45 | R1.1 112.37,82.98 R2.1 | C1.- 114.96,80.39 R2.1 | FILAMENT_PWR.1 v105.41,73.66 | v111.12,79.38 111.12,81.64 R2.1 | R8.1 115.82,22.61 118.11,20.64 124.46,20.64 127,22.86 127,44.45 128.27,45.72 128.27,52.45
INPUT_L
  Bottom 1.27: INPUT.3 137.82,61.54 C5.1
INPUT_R
  Bottom 1.27: INPUT.1 137.82,42.72 C6.1
N$1
  Bottom 1.27: C5.2 127.36,99.42 125.73,97.79 125.73,90.45 R1.2 125.73,84.05 125.73,74.93 119.35,69.82 119.38,63.5 121.25,61.63 V1.2
N$2
  Bottom 1.27: R2.2 120.04,80.39 C1.+ 115.88,71.15 V1.3
N$3
  Bottom 1.27: V1.1 123.7,57.66 120.33,57.47 115.57,57.47 112.39,60.64 112.39,71.75 104.14,80.01 104.14,85.13 R5.A
N$4
  Bottom 1.27: Q3.G 109.83,100.94 107.95,99.06 107.95,94.02 R5.S
N$5
  Bottom 1.27: IC1.3 96.27,97.79 | 96.27,97.79 96.27,88.9 | 96.27,88.9 96.27,80.11 C3.+ | TP3.TP 100.78,97.85 96.27,97.79 | Q3.S 119.76,96.9 118.11,95.25 114.3,95.25 113.03,93.98 113.03,91.44 109.54,88.58 96.58,88.58 96.27,88.9
N$6
  Bottom 1.27: IC1.2 93.73,95.99 R3.2
N$7
  Bottom 1.27: C6.2 127.36,4.72 125.73,6.35 125.73,15.47 R7.2 122.53,17.12 121.92,16.51 111.76,16.51 110.49,17.78 110.49,39.19 V1.7
N$8
  Bottom 0.61: U1.5 70.48,53.98 R11.1
N$9
  Bottom 1.27: R9.2 93.64,3.24 IC2.2
N$10
  Bottom 1.27: V1.8 121.38,31.57 C2.+ 120.04,25.15 R8.2
N$11
  Bottom 1.27: V1.6 111.9,46.18 107.31,41.59 107.31,18.82 R6.A
N$12
  Bottom 1.27: Q4.G 120.27,9.27 118.11,11.43 105.05,11.43 R6.S
N$13  (via drill 1.2 pad 2.54)
  Top 1.27: v99.06,6.99 v91.12,6.99
  Bottom 1.27: Q4.S 109.88,3.2 109.22,2.54 101.6,2.54 101.6,2.95 TP4.TP 100.99,5.69 v99.06,6.99 | IC2.3 91.06,7.62 | 91.06,7.62 91.06,26.01 C4.+ | v91.12,6.99 91.06,7.62
N$14
  Bottom 1.27: D6.C 53.34,5.08 IC5.2
N$15
  Bottom 1.27: IC3.2 22.23,5.71 22.86,6.35 D1.A 25.4,6.35 R12.P$2 28.57,8.89 29.84,10.16 33.02,10.16 F1.1 34.29,15.24 33.02,16.51 31.75,16.51 D2.C
N$16
  Bottom 1.27: F1.2 34.29,2.52 TP1.TP 35.84,3.81 PSU_AMP_OUT.2
N$17
  Bottom 1.27: IC3.1 29.84,3.17 30.48,3.81 R13.P$2 30.48,7.62 31.11,8.26 36.2,8.26 36.83,8.89 36.83,15.24 D2.A C9.+ 27.3,20.95 C12.+ 27.94,20.32 R12.P$1
N$18
  Bottom 1.27: R14.E 26.04,10.79 26.67,11.43 27.94,11.43 R13.P$1
N$19
  Bottom 1.27: IC5.3 49.53,4.45 D5.A 48.9,9.53 48.9,17.14 C13.1 TP5.TP PSU_HEATER_OUT.2
N$20
  Bottom 1.27: FILAMENT_PWR.2 107,64.45 107.95,63.5 107.95,58.1 113.03,53.02 113.03,50.8 115.57,48.26 124.48,48.26 V1.9
N$21
  Bottom 1.27: AUDIO.1 163.83,34.29 arc-90 162.56,35.56 arc90 161.29,36.83 158.75,36.83 arc-90 156.21,39.37 156.21,40.64 arc90 K1.P1
N$22
  Bottom 1.27: K1.16 D3.A 166.37,55.24 167,54.61 CTRL.1
N$23
  Bottom 0.61: R15.P$1 62.25,92.71 SW2.4
N$24
  Bottom 0.61: TUBE_LIGHT1.1 125.09,64.77 129.54,58.74 129.54,55.88 127.64,53.98 119.06,53.98 LED2.A
N$25
  Bottom 0.61: SW1.1 74.3,82.55 73.66,82.23 64.77,82.23 | 64.77,82.23 63.18,82.23 62.23,83.82 SW2.1 | C14.2 63.5,71.75 D7.C 66.04,77.47 IC6.1 64.77,81.28 64.77,82.23
N$26
  Bottom 0.61: R16.P$1 74.32,88.27 SW1.2
N$27
  Bottom 1.27: AUDIO.3 165.74,40.01 arc90 161.29,44.45 K1.P2
N$28
  Bottom 1.27: K1.S1 152.4,30.79 arc90 JP1.TIP
N$29
  Bottom 1.27: AUDIO.2 167.64,36.83 arc-90 168.28,36.2 168.28,32.1 arc-90 JP1.SLEEVE
N$30
  Bottom 1.27: K1.S2 160.02,30.15 arc-90 JP1.RING
N$31
  Bottom 1.27: VOL_IN.3 157.48,84.16 VOLUME.I2
N$32  (1 unrouted)
N$33
  Bottom 1.27: VOL_IN.1 162.56,88.24 VOLUME.I1
N$34
  Bottom 1.27: VOL_OUT.3 149.22,81.92 152.4,78.74 VOLUME.O2
N$35
  Bottom 1.27: VOL_OUT.1 154.31,83.19 156.21,81.28 164.52,81.28 VOLUME.O1
N$36
  Bottom 1.27: PSU_SW.2 12.06,5.08 13.34,6.35 13.34,12.53 J2.3
N$37
  Bottom 1.27: D3.C K1.1 154.94,49.53 163.83,49.53 164.47,50.16 CTRL.2
N$38
  Bottom 0.61: LED1.A 63.5,54.61 R11.2 TUBE_LIGHT.1
N$39
  Bottom 0.61: SW2.5 55.27,92.69 R17.P$1
N$40
  Bottom 0.61: R18.1 69.85,47.62 U1.6
N$41
  Bottom 0.61: R18.2 66.04,40.01 Q2.2
N$42
  Bottom 0.61: DELAY_CTRL.1 59.69,44.45 Q2.1
N$43
  Bottom 0.61: U1.7 72.39,45.72 74.93,43.18 74.93,40.32 JP2.1
N$44
  Bottom 0.61: R19.1 78.08,43.16 U1.1
N$45
  Bottom 0.61: U1.2 77.47,45.72 73.66,49.53 73.66,53.52 JP3.1
N$46
  Bottom 0.61: U1.3 77.47,48.26 75.56,50.16 75.56,53.95 JP3.2
N$47
  Bottom 1.27: PSU_SW.1 D4.A
N$48
  Bottom 0.61: SW1.7 68.61,88.29 R20.P$1
N$50
  Bottom 0.61: INSEL_IN_A.1 61.59,95.89 60.33,93.34 60.33,91.44 60.96,90.81 61.91,90.81 SW2.3
N$51
  Bottom 0.61: INSEL_IN_A.3 59.05,95.89 59.05,91.44 58.42,90.81 57.47,90.81 SW2.6
N$52
  Bottom 0.61: SW1.3 75.25,90.49 76.2,91.44 76.2,93.47 76.02,93.65 75.59,93.65 73.66,95.58 INSEL_IN_B.1
N$53
  Bottom 0.61: INSEL_IN_B.3 68.58,97.92 71.12,93.98 71.12,91.44 70.48,90.81 69.53,90.81 SW1.6
N$54
  Bottom 0.406: 65.38,89.38 60.17,89.38
  Bottom 0.61: SW2.7 58.4,88.29 58.74,87.95 | 58.74,87.95 59.05,87.63 59.05,81.92 57.15,80.01 INSEL_OUT.3 | SW1.5 68.56,92.69 65.38,89.51 65.38,89.38 | 60.17,89.38 58.74,87.95 | 58.74,87.95 58.79,87.95 59.08,87.66
N$55
  Bottom 0.61: INSEL_OUT.1 62.23,80.01 60.33,81.92 60.33,87.63 60.98,88.29 SW2.2 62.89,87.63 64.77,87.63 65.35,86.41 65.84,85.37 67.77,85.37 68.68,86.31 72.39,86.36 72.39,91.44 73.64,92.69 SW1.4
N$56
  Bottom 0.61: R21.2 69.85,67.94 Q1.2
N$57
  Bottom 0.61: INSEL_CTRL.1 54.61,68.58 55.88,69.85 61.62,69.85 62.76,68.71 64.9,68.71 66.04,69.85 66.04,71.12 68.58,73.66 69.85,73.66 IC6.3
N$58
  Bottom 0.61: INSEL_CTRL.2 57.15,67.31 58.42,68.58 60.96,68.58 62.23,67.31 R21.1
N$59
  Bottom 0.61: INSEL_CTRL.3 59.69,64.77 60.96,63.5 71.12,63.5 73.66,66.04 Q1.3
N$60  (via drill 0.9 pad 1.78, 1.2 pad 2.18)
  Top 0.61: v57.15,82.55 65.28,82.55 | 65.28,82.55 v66.65,83.92 | 65.28,82.55 73.66,82.55 v73.66,78.74
  Bottom 0.61: SW2.8 v57.15,82.55 | v66.65,83.92 68.05,83.92 SW1.8 | Q1.1 D7.A | C14.1 70.48,71.12 D7.A | D7.A v73.66,78.74 72.39,80.01 72.34,80.01 71.7,80.64 IC6.2
N$61
  Bottom 1.27: RCA_IN.2 7.81,72.39 | 7.81,72.39 X2.S | X3.S 6.35,59.69 7.62,60.96 7.62,72.2 7.81,72.39
N$62
  Bottom 1.27: X3.T 14.19,64.99 RCA_IN.1
N$63
  Bottom 1.27: X2.T 12.48,81.5 RCA_IN.3
N$64
  Bottom 1.27: X1.S1 8.89,90.17 | 8.89,90.17 X1.S2 8.89,90.02 X1.4 | USB_IN.1 8.89,90.17
N$65
  Bottom 1.27: USB_IN.4 12.7,97.79 11.43,96.52 11.43,95.4 X1.3
N$66
  Bottom 1.27: X1.2 19.03,95.23 USB_IN.3
N$67
  Bottom 1.27: X1.1 19.03,92.73 USB_IN.2
OUTPUT_L
  Bottom 1.27: OUTPUT.1 R4.2 87.02,68.33 C3.-
OUTPUT_R
  Bottom 1.27: OUTPUT.3 R10.2 87.02,37.21 C4.-
VCC  (via drill 1.2 pad 2.18, 1.2 pad 2.54)  (2 unrouted)
  Top 0.254: v44.45,15.24 48.9,10.79 v57.15,10.79
  Bottom 0.61: DLY_PWR1.1 62.23,34.29 63.5,35.56 C16.1 66.04,35.56 67.31,34.29 67.31,32.38 IC4.2
  Bottom 1.27: IC3.3 15.88,3.17 D4.C 15.24,5.08 D1.C 16.51,8.89 C11.1 16.51,13.02 16.51,13.97 15.24,15.24 v15.24,16.51 16.51,17.78 16.51,21.59 15.24,22.86 PSU_AUX1.2 | PSU_AUX2.2 PSU_AUX1.2 | PSU_AUX.2 v44.45,15.24 v44.45,22.86 44.45,30.05 C8.+ 41.48,33.02 C7.+ PSU_AUX1.2 | IC5.1 55.88,6.35 57.15,7.62 D5.C v57.15,10.79 C10.1 | FILAMENT_PWR.3 105.41,57.29 V1.5

### Text on the board
Bottom: GrubDAC | NP-100v12 | ROGGOM | noti | 2017
tDocu: VCC | GND | CTRL